# Altium schematic sheet eeprom.SchDoc
size A3; DocumentNumber: 7; SheetNumber: 7; SheetTotal: 11; SheetDescription: EEPROM via I2C
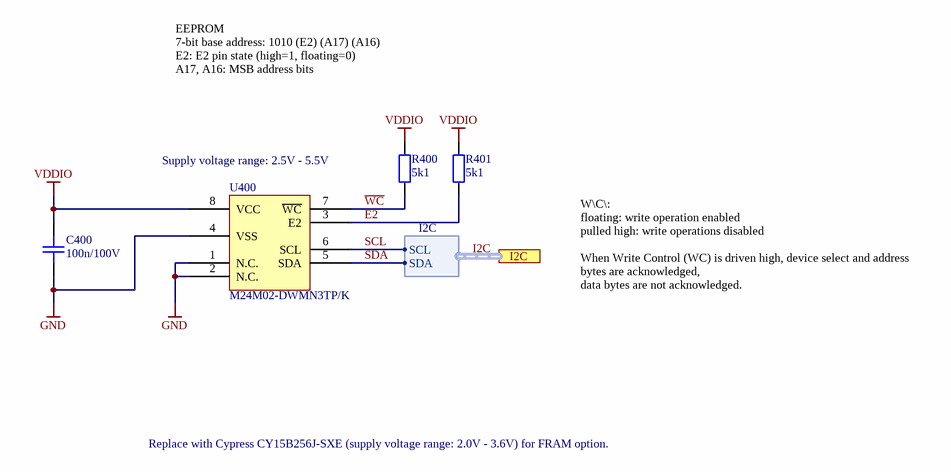
[diagram p0: eeprom.SchDoc]

## Parts
C400  100n/100V  [CAPC1608X08N]
R400  5k1  [RESC1608X05N]
R401  5k1  [RESC1608X05N]
U400  M24M02-DWMN3TP/K  [SOIC127P600X175-8N]

## Ports
I2C (harness I2C)

## Harnesses
I2C: SCL, SDA

## Nets
GND: C400.1 U400.1(N.C.) U400.2(N.C.) U400.4(VSS)
VDDIO: C400.2 R400.2 R401.2 U400.8(VCC)
E2: R401.1 U400.3(E2)
SCL: U400.6(SCL) ; port I2C.SCL  [project net I2C.SCL]
SDA: U400.5(SDA) ; port I2C.SDA  [project net I2C.SDA]
~{WC}: R400.1 U400.7(~{WC})

## Buses and harness runs
harness I2C = port I2C

## Notes on the sheet
- EEPROM
  7-bit base address: 1010 (E2) (A17) (A16)
  E2: E2 pin state (high=1, floating=0)
  A17, A16: MSB address bits
- Supply voltage range: 2.5V - 5.5V
- W\C\:
  floating: write operation enabled
  pulled high: write operations disabled
  When Write Control (WC) is driven high, device select and address bytes are acknowledged,
  data bytes are not acknowledged.
- Replace with Cypress CY15B256J-SXE (supply voltage range: 2.0V - 3.6V) for FRAM option.
- Fraunhofer IISB
- Schottkystr. 10
- developed by:
- 91058 Erlangen
- Germany
- Author
- Project
- License
- Description
- File
- Version
- Release Date
- Sheet
- foxbms.org <https://foxbms.org>
- www.iisb.fraunhofer.de <https://www.iisb.fraunhofer.de/>
- foxBMS Team
- /

## Library data of the parts
C400 = gen_C_ceramic_100n_100V_X7R_0603: MLCC; Capacitance: 100n; Rated Voltage: 100V; Dielectric: X7R; Case EIA: 0603; Case Metric: 1608; Automotive Qualified: True; PnP Package: 0603C; Part Number: gen_C_ceramic_100n_100V_X7R_0603; Supplier 1: Digikey; Supplier Part Number 1: 490-13420-1-ND; Supplier 2: Mouser; Supplier Part Number 2: 81-GCJ188R72A104KA1D
R400 = gen_R_5k1_0603: SMD Resistor 5k1 0603; Tolerance: 5%; Power: 0.1W; Case EIA: 0603; Case Metric: 1608; Maximum Working Voltage: 75V; PnP Package: 0603R; Automotive Qualified: True; AEC-Q Norm: AEC-Q200; Part Number: gen_R_5k1_0603; Operating Temperature: -55°C - +155°C; Resistance: 5k1; Series: E24; PnP Value: 5k1; Supplier 1: Mouser; Supplier Part Number 1: 667-ERJ-3GEYJ512V; ECCN: EAR99
R401 = gen_R_5k1_0603: SMD Resistor 5k1 0603; Power: 0.1W; Case EIA: 0603; Case Metric: 1608; Maximum Working Voltage: 75V; PnP Package: 0603R; Automotive Qualified: True; Tolerance: 5%; AEC-Q Norm: AEC-Q200; Part Number: gen_R_5k1_0603; Operating Temperature: -55°C - +155°C; Resistance: 5k1; Series: E24; PnP Value: 5k1; Supplier 1: Mouser; Supplier Part Number 1: 667-ERJ-3GEYJ512V; ECCN: EAR99
U400 = M24M02-DWMN3TP/K: Automotive 2-Mbit serial I²C / bus EEPROM with 1 MHz clock; Manufacturer: STMicroelectronics; PnP Package: SO8N; Automotive Qualified: True; Part Number: M24M02-DWMN3TP/K; Part Name: M24M02-DWMN3TP/K; Operating Temperature: -40°C - +125°C; ComponentLink1Description: Datasheet; ComponentLink1URL: http://www.st.com/content/ccc/resource/technical/document/datasheet/83/f4/3e/e4/4e/49/42/c5/DM00200595.pdf/files/DM00200595.pdf/jcr:content/translations/en.DM00200595.pdf; Supplier 1: Digikey; Supplier Part Number 1: 497-16238-1-ND; Supplier 2: Mouser; Supplier Part Number 2: 511-M24M02-DWMN3TP/K; Supplier 3: Farnell; Supplier Part Number 3: 2849971